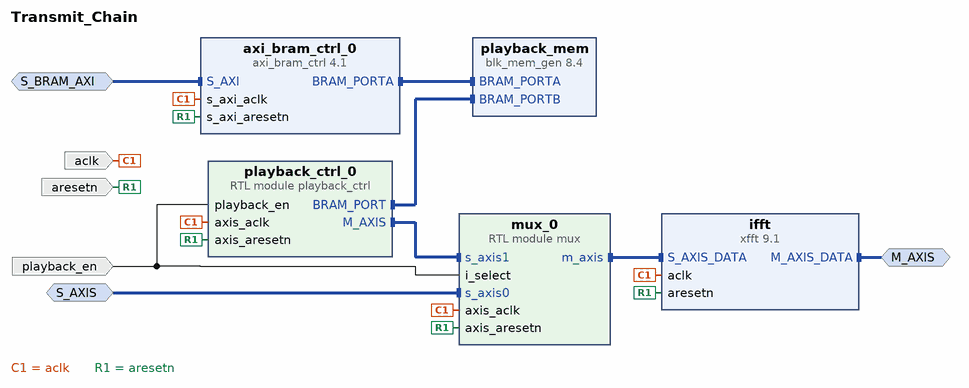
[diagram p0: block diagram of the top level]
# Vivado block design Transmit_Chain, xc7z010clg400-1, Vivado 2022.1
create_bd_design Transmit_Chain

create_bd_intf_port -mode Master -vlnv xilinx.com:interface:axis_rtl:1.0 M_AXIS
create_bd_intf_port -mode Slave -vlnv xilinx.com:interface:axis_rtl:1.0 S_AXIS
set_property -dict [list \
  CONFIG.HAS_TKEEP 0 \
  CONFIG.HAS_TLAST 1 \
  CONFIG.HAS_TREADY 1 \
  CONFIG.HAS_TSTRB 0 \
  CONFIG.LAYERED_METADATA undef \
  CONFIG.TDATA_NUM_BYTES 4 \
  CONFIG.TDEST_WIDTH 0 \
  CONFIG.TID_WIDTH 8 \
  CONFIG.TUSER_WIDTH 8 \
] [get_bd_intf_ports S_AXIS]
create_bd_intf_port -mode Slave -vlnv xilinx.com:interface:aximm_rtl:1.0 S_BRAM_AXI
set_property -dict [list \
  CONFIG.ADDR_WIDTH 15 \
  CONFIG.ARUSER_WIDTH 0 \
  CONFIG.AWUSER_WIDTH 0 \
  CONFIG.BUSER_WIDTH 0 \
  CONFIG.DATA_WIDTH 32 \
  CONFIG.HAS_BRESP 1 \
  CONFIG.HAS_BURST 1 \
  CONFIG.HAS_CACHE 1 \
  CONFIG.HAS_LOCK 1 \
  CONFIG.HAS_PROT 1 \
  CONFIG.HAS_QOS 0 \
  CONFIG.HAS_REGION 0 \
  CONFIG.HAS_RRESP 1 \
  CONFIG.HAS_WSTRB 1 \
  CONFIG.ID_WIDTH 0 \
  CONFIG.MAX_BURST_LENGTH 256 \
  CONFIG.NUM_READ_OUTSTANDING 2 \
  CONFIG.NUM_READ_THREADS 1 \
  CONFIG.NUM_WRITE_OUTSTANDING 2 \
  CONFIG.NUM_WRITE_THREADS 1 \
  CONFIG.PROTOCOL AXI4 \
  CONFIG.READ_WRITE_MODE READ_WRITE \
  CONFIG.RUSER_BITS_PER_BYTE 0 \
  CONFIG.RUSER_WIDTH 0 \
  CONFIG.SUPPORTS_NARROW_BURST 1 \
  CONFIG.WUSER_BITS_PER_BYTE 0 \
  CONFIG.WUSER_WIDTH 0 \
] [get_bd_intf_ports S_BRAM_AXI]
create_bd_port -dir I -type clk aclk
create_bd_port -dir I -type rst aresetn
create_bd_port -dir I playback_en

create_bd_cell -type ip -vlnv xilinx.com:ip:axi_bram_ctrl:4.1 axi_bram_ctrl_0
set_property -dict {CONFIG.SINGLE_PORT_BRAM 1} [get_bd_cells axi_bram_ctrl_0]
create_bd_cell -type ip -vlnv xilinx.com:ip:xfft:9.1 ifft
set_property -dict [list \
  CONFIG.aresetn true \
  CONFIG.data_format fixed_point \
  CONFIG.implementation_options automatically_select \
  CONFIG.number_of_stages_using_block_ram_for_data_and_phase_factors 3 \
  CONFIG.run_time_configurable_transform_length false \
  CONFIG.target_clock_frequency 100 \
] [get_bd_cells ifft]
create_bd_cell -type module -reference mux mux_0
create_bd_cell -type module -reference playback_ctrl playback_ctrl_0
create_bd_cell -type ip -vlnv xilinx.com:ip:blk_mem_gen:8.4 playback_mem
set_property -dict [list \
  CONFIG.Assume_Synchronous_Clk false \
  CONFIG.Enable_B Use_ENB_Pin \
  CONFIG.Memory_Type True_Dual_Port_RAM \
  CONFIG.Port_B_Clock 100 \
  CONFIG.Port_B_Enable_Rate 100 \
  CONFIG.Port_B_Write_Rate 50 \
  CONFIG.Use_RSTB_Pin true \
] [get_bd_cells playback_mem]

# ---- connections ----

connect_bd_intf_net -intf_net S_AXI_0_1 [get_bd_intf_ports S_BRAM_AXI] [get_bd_intf_pins axi_bram_ctrl_0/S_AXI]
connect_bd_intf_net [get_bd_intf_pins axi_bram_ctrl_0/BRAM_PORTA] [get_bd_intf_pins playback_mem/BRAM_PORTA]
connect_bd_intf_net [get_bd_intf_pins ifft/S_AXIS_DATA] [get_bd_intf_pins mux_0/m_axis]
connect_bd_intf_net [get_bd_intf_pins playback_ctrl_0/BRAM_PORT] [get_bd_intf_pins playback_mem/BRAM_PORTB]
connect_bd_intf_net [get_bd_intf_pins mux_0/s_axis1] [get_bd_intf_pins playback_ctrl_0/M_AXIS]
connect_bd_intf_net -intf_net s_axis0_0_1 [get_bd_intf_ports S_AXIS] [get_bd_intf_pins mux_0/s_axis0]
connect_bd_intf_net -intf_net xfft_0_M_AXIS_DATA [get_bd_intf_ports M_AXIS] [get_bd_intf_pins ifft/M_AXIS_DATA]
connect_bd_net -net i_select_0_1 [get_bd_ports playback_en] [get_bd_pins mux_0/i_select] [get_bd_pins playback_ctrl_0/playback_en]
connect_bd_net -net s_axi_aclk_0_1 [get_bd_ports aclk] \
  [get_bd_pins axi_bram_ctrl_0/s_axi_aclk] [get_bd_pins ifft/aclk] [get_bd_pins mux_0/axis_aclk] \
  [get_bd_pins playback_ctrl_0/axis_aclk]
connect_bd_net -net s_axi_aresetn_0_1 [get_bd_ports aresetn] \
  [get_bd_pins axi_bram_ctrl_0/s_axi_aresetn] [get_bd_pins ifft/aresetn] [get_bd_pins mux_0/axis_aresetn] \
  [get_bd_pins playback_ctrl_0/axis_aresetn]

# ---- address map ----
assign_bd_address -offset 0x0000 -range 4K -target_address_space [get_bd_addr_spaces S_BRAM_AXI] [get_bd_addr_segs axi_bram_ctrl_0/S_AXI/Mem0]

validate_bd_design
save_bd_design
